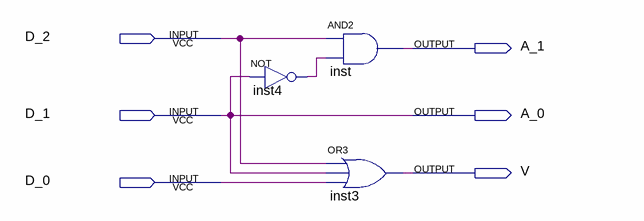
[diagram p0: schematic sheet]
// Quartus schematic hw6p2.bdf as structural Verilog: 3 symbols, 6 pins
module hw6p2 (
  input  D_2,
  input  D_1,
  input  D_0,
  output A_1,
  output A_0,
  output V
);

  wire inst4_out;

  not inst4 (inst4_out, D_1);
  and inst (A_1, D_2, inst4_out);
  or inst3 (V, D_2, D_1, D_0);

  assign A_0 = D_1;
endmodule
